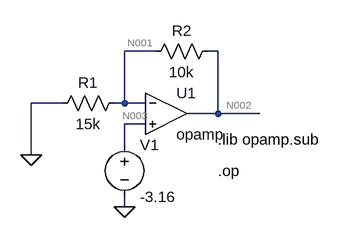
[diagram p0: schematic pag7es5.asc]
pag7es5.asc, the LTspice schematic file:
Version 4
SHEET 1 880 680
WIRE 208 32 160 32
WIRE 304 32 288 32
WIRE 64 112 16 112
WIRE 160 112 160 32
WIRE 160 112 144 112
WIRE 192 112 160 112
WIRE 304 128 304 32
WIRE 304 128 256 128
WIRE 368 128 304 128
WIRE 192 144 160 144
WIRE 160 176 160 144
WIRE 16 192 16 112
WIRE 160 272 160 256
FLAG 16 192 0
FLAG 160 272 0
SYMBOL res 160 96 R90
WINDOW 0 0 56 VBottom 2
WINDOW 3 32 56 VTop 2
SYMATTR InstName R1
SYMATTR Value 15k
SYMBOL OpAmps\\opamp 224 64 R0
SYMATTR InstName U1
SYMBOL voltage 160 160 R0
SYMATTR InstName V1
SYMATTR Value -3.16
SYMBOL res 304 16 R90
WINDOW 0 0 56 VBottom 2
WINDOW 3 32 56 VTop 2
SYMATTR InstName R2
SYMATTR Value 10k
TEXT 304 168 Left 2 !.lib opamp.sub
TEXT 304 216 Left 2 !.op

The netlist it stands for:
* pag7es5.asc
R1 N001 0 15k
XU1 N001 N003 N002 opamp Aol=100K GBW=10Meg  ; pins invin noninvin out
V1 N003 0 -3.16
R2 N002 N001 10k
.lib opamp.sub
.op
.backanno
.end

* Results of the author's LTspice run, read from the files saved beside the schematic
* Operating Point:
*   V(n001) = -3.16 V
*   V(n002) = -5.267 V
*   V(n003) = -3.16 V
*   I(R2) = -210.7 µA
*   I(R1) = -210.7 µA
*   I(V1) = 0 A
*   Ix(u1:3) = 210.7 µA